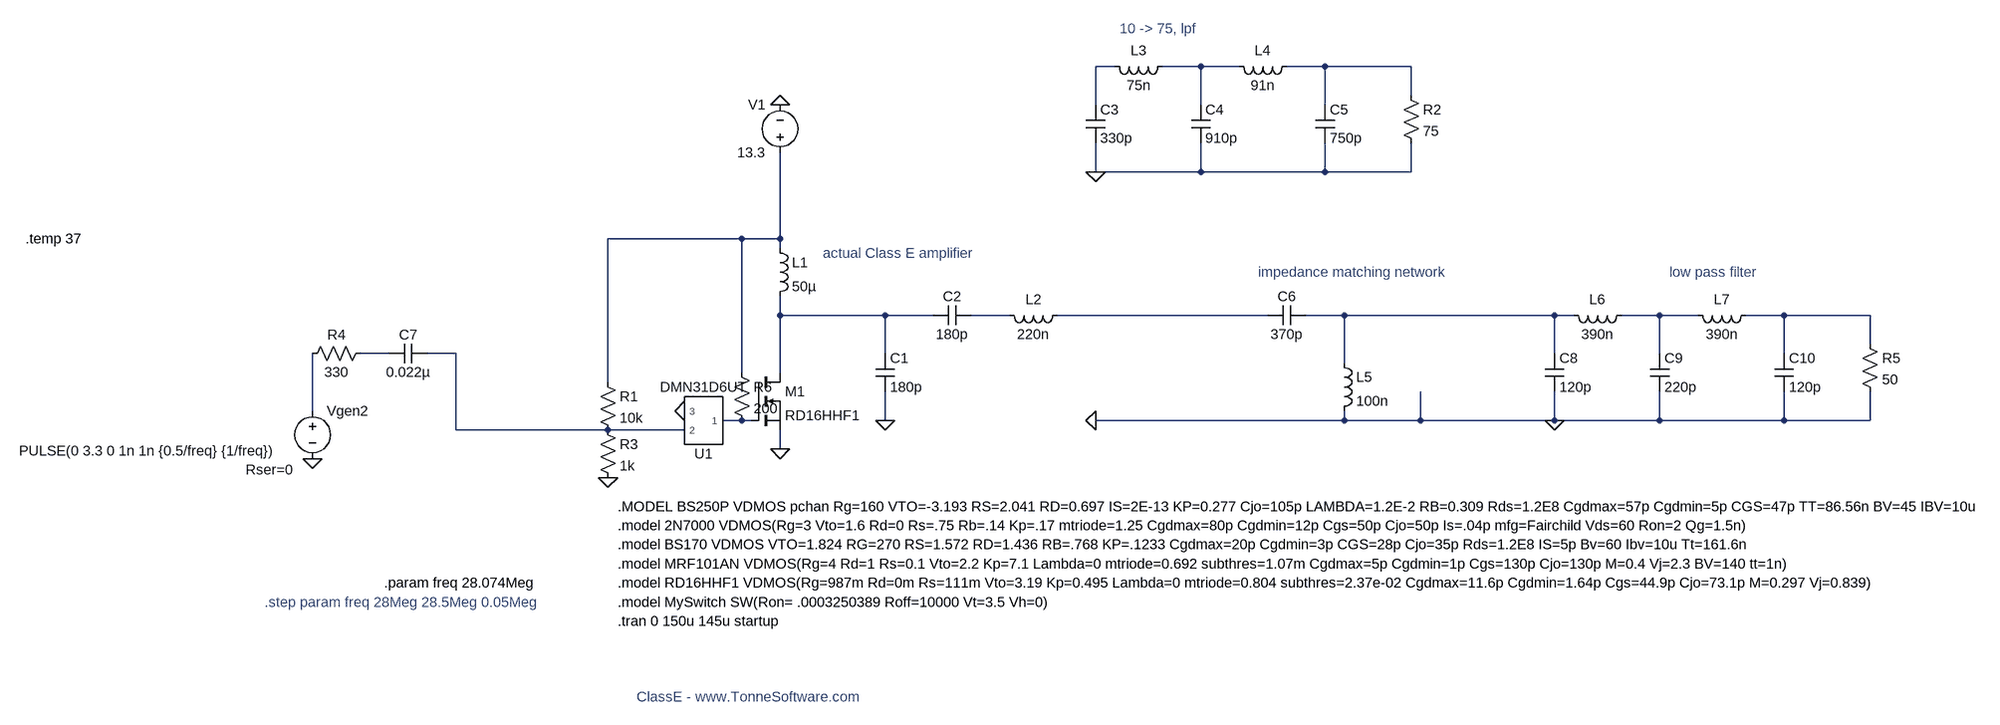
[diagram p0: schematic 28mhz_class_e_new.asc]
28mhz_class_e_new.asc, the LTspice schematic file:
Version 4
SHEET 1 2496 912
WIRE 832 -528 800 -528
WIRE 976 -528 912 -528
WIRE 1040 -528 976 -528
WIRE 1184 -528 1120 -528
WIRE 1328 -528 1184 -528
WIRE 1328 -480 1328 -528
WIRE 800 -464 800 -528
WIRE 976 -464 976 -528
WIRE 1184 -464 1184 -528
WIRE 800 -352 800 -400
WIRE 976 -352 976 -400
WIRE 976 -352 800 -352
WIRE 1184 -352 1184 -400
WIRE 1184 -352 976 -352
WIRE 1328 -352 1328 -400
WIRE 1328 -352 1184 -352
WIRE 208 -240 -16 -240
WIRE 272 -240 272 -384
WIRE 272 -240 208 -240
WIRE 272 -224 272 -240
WIRE 272 -112 272 -144
WIRE 448 -112 272 -112
WIRE 528 -112 448 -112
WIRE 656 -112 592 -112
WIRE 1088 -112 736 -112
WIRE 1216 -112 1152 -112
WIRE 1568 -112 1216 -112
WIRE 1600 -112 1568 -112
WIRE 1744 -112 1680 -112
WIRE 1808 -112 1744 -112
WIRE 1952 -112 1888 -112
WIRE 2096 -112 1952 -112
WIRE 2096 -64 2096 -112
WIRE -544 -48 -592 -48
WIRE -432 -48 -480 -48
WIRE 448 -48 448 -112
WIRE 1568 -48 1568 -112
WIRE 1744 -48 1744 -112
WIRE 1952 -48 1952 -112
WIRE 1216 -32 1216 -112
WIRE 208 -16 208 -240
WIRE 272 -16 272 -112
WIRE -16 0 -16 -240
WIRE -672 48 -672 -48
WIRE 208 64 176 64
WIRE 224 64 208 64
WIRE 448 64 448 16
WIRE 1216 64 1216 48
WIRE 1216 64 800 64
WIRE 1344 64 1344 16
WIRE 1344 64 1216 64
WIRE 1568 64 1568 16
WIRE 1568 64 1344 64
WIRE 1744 64 1744 16
WIRE 1744 64 1568 64
WIRE 1952 64 1952 16
WIRE 1952 64 1744 64
WIRE 2096 64 2096 16
WIRE 2096 64 1952 64
WIRE -432 80 -432 -48
WIRE -16 80 -432 80
WIRE 112 80 -16 80
WIRE 272 112 272 80
FLAG 272 112 0
FLAG 448 64 0
FLAG 800 64 0
FLAG -672 128 0
FLAG 800 -352 0
FLAG 1568 64 0
FLAG 272 -464 0
FLAG -16 160 0
FLAG 112 48 0
SYMBOL ind 256 -240 R0
SYMATTR InstName L1
SYMATTR Value 50µ
SYMBOL cap 432 -48 R0
SYMATTR InstName C1
SYMATTR Value 180p
SYMBOL cap 592 -128 R90
WINDOW 0 0 32 VBottom 2
WINDOW 3 32 32 VTop 2
SYMATTR InstName C2
SYMATTR Value 180p
SYMBOL nmos 224 -16 R0
SYMATTR InstName M1
SYMATTR Value RD16HHF1
SYMBOL voltage -672 32 R0
WINDOW 123 24 132 Left 0
WINDOW 39 -112 115 Left 2
WINDOW 3 -491 83 Left 2
SYMATTR SpiceLine Rser=0
SYMATTR Value PULSE(0 3.3 0 1n 1n {0.5/freq} {1/freq})
SYMATTR InstName Vgen2
SYMBOL ind 928 -544 R90
WINDOW 0 5 56 VBottom 2
WINDOW 3 32 56 VTop 2
SYMATTR InstName L3
SYMATTR Value 75n
SYMBOL ind 1136 -544 R90
WINDOW 0 5 56 VBottom 2
WINDOW 3 32 56 VTop 2
SYMATTR InstName L4
SYMATTR Value 91n
SYMBOL cap 784 -464 R0
SYMATTR InstName C3
SYMATTR Value 330p
SYMBOL cap 960 -464 R0
SYMATTR InstName C4
SYMATTR Value 910p
SYMBOL cap 1168 -464 R0
SYMATTR InstName C5
SYMATTR Value 750p
SYMBOL res 1312 -496 R0
SYMATTR InstName R2
SYMATTR Value 75
SYMBOL cap 1152 -128 R90
WINDOW 0 0 32 VBottom 2
WINDOW 3 32 32 VTop 2
SYMATTR InstName C6
SYMATTR Value 370p
SYMBOL ind 1200 -48 R0
SYMATTR InstName L5
SYMATTR Value 100n
SYMBOL ind 1696 -128 R90
WINDOW 0 5 56 VBottom 2
WINDOW 3 32 56 VTop 2
SYMATTR InstName L6
SYMATTR Value 390n
SYMBOL ind 1904 -128 R90
WINDOW 0 5 56 VBottom 2
WINDOW 3 32 56 VTop 2
SYMATTR InstName L7
SYMATTR Value 390n
SYMBOL cap 1552 -48 R0
SYMATTR InstName C8
SYMATTR Value 120p
SYMBOL cap 1728 -48 R0
SYMATTR InstName C9
SYMATTR Value 220p
SYMBOL cap 1936 -48 R0
SYMATTR InstName C10
SYMATTR Value 120p
SYMBOL res 2080 -80 R0
SYMATTR InstName R5
SYMATTR Value 50
SYMBOL voltage 272 -368 R180
WINDOW 0 24 96 Left 2
WINDOW 3 24 16 Left 2
WINDOW 123 0 0 Left 0
WINDOW 39 0 0 Left 0
SYMATTR InstName V1
SYMATTR Value 13.3
SYMBOL res -576 -64 R90
WINDOW 0 0 56 VBottom 2
WINDOW 3 32 56 VTop 2
SYMATTR InstName R4
SYMATTR Value 330
SYMBOL ind 752 -128 R90
WINDOW 0 5 56 VBottom 2
WINDOW 3 32 56 VTop 2
SYMATTR InstName L2
SYMATTR Value 220n
SYMBOL res -32 -16 R0
SYMATTR InstName R1
SYMATTR Value 10k
SYMBOL res -32 64 R0
SYMATTR InstName R3
SYMATTR Value 1k
SYMBOL res 192 -32 R0
SYMATTR InstName R6
SYMATTR Value 200
SYMBOL cap -480 -64 R90
WINDOW 0 0 32 VBottom 2
WINDOW 3 32 32 VTop 2
SYMATTR InstName C7
SYMATTR Value 0.022µ
SYMBOL DMN31D6UT 144 64 R180
SYMATTR InstName U1
TEXT 0 368 Left 2 !.model MySwitch SW(Ron= .0003250389 Roff=10000 Vt=3.5 Vh=0)
TEXT 0 400 Left 2 !.tran 0 150u 145u startup
TEXT 32 528 Left 2 ;ClassE - www.TonneSoftware.com
TEXT 0 336 Left 2 !.model RD16HHF1 VDMOS(Rg=987m Rd=0m Rs=111m Vto=3.19 Kp=0.495 Lambda=0 mtriode=0.804 subthres=2.37e-02 Cgdmax=11.6p Cgdmin=1.64p Cgs=44.9p Cjo=73.1p M=0.297 Vj=0.839)
TEXT 344 -216 Left 2 ;actual Class E amplifier
TEXT -552 336 Left 2 !.param freq 28.074Meg
TEXT -752 368 Left 2 ;.step param freq 28Meg 28.5Meg 0.05Meg
TEXT 840 -592 Left 2 ;10 -> 75, lpf
TEXT 1072 -184 Left 2 ;impedance matching network
TEXT 1760 -184 Left 2 ;low pass filter
TEXT 0 304 Left 2 !.model MRF101AN VDMOS(Rg=4 Rd=1 Rs=0.1 Vto=2.2 Kp=7.1 Lambda=0 mtriode=0.692 subthres=1.07m Cgdmax=5p Cgdmin=1p Cgs=130p Cjo=130p M=0.4 Vj=2.3 BV=140 tt=1n)
TEXT 0 272 Left 2 !.model BS170 VDMOS VTO=1.824 RG=270 RS=1.572 RD=1.436 RB=.768 KP=.1233 Cgdmax=20p Cgdmin=3p CGS=28p Cjo=35p Rds=1.2E8 IS=5p Bv=60 Ibv=10u Tt=161.6n
TEXT 0 240 Left 2 !.model 2N7000 VDMOS(Rg=3 Vto=1.6 Rd=0 Rs=.75 Rb=.14 Kp=.17 mtriode=1.25 Cgdmax=80p Cgdmin=12p Cgs=50p Cjo=50p Is=.04p mfg=Fairchild Vds=60 Ron=2 Qg=1.5n)
TEXT 0 208 Left 2 !.MODEL BS250P VDMOS pchan Rg=160 VTO=-3.193 RS=2.041 RD=0.697 IS=2E-13 KP=0.277 Cjo=105p LAMBDA=1.2E-2 RB=0.309 Rds=1.2E8 Cgdmax=57p Cgdmin=5p CGS=47p TT=86.56n BV=45 IBV=10u
TEXT -1152 -240 Left 2 !.temp 37

The netlist it stands for:
* 28mhz_class_e_new.asc
L1 N004 N005 50µ
C1 N005 0 180p
C2 N006 N005 180p
M1 N005 N014 0 0 RD16HHF1
Vgen2 N013 0 PULSE(0 3.3 0 1n 1n {0.5/freq} {1/freq}) Rser=0
L3 N002 N001 75n
L4 N003 N002 91n
C3 N001 0 330p
C4 N002 0 910p
C5 N003 0 750p
R2 N003 0 75
C6 N008 N007 370p
L5 N008 0 100n
L6 N009 N008 390n
L7 N010 N009 390n
C8 N008 0 120p
C9 N009 0 220p
C10 N010 0 120p
R5 N010 0 50
V1 N004 0 13.3
R4 N011 N013 330
L2 N007 N006 220n
R1 N004 N012 10k
R3 N012 0 1k
R6 N004 N014 200
C7 N012 N011 0.022µ
XU1 N014 N012 0 DMN31D6UT  ; pins 1 2 3
.model NMOS NMOS
.model PMOS PMOS
.lib standard.mos
.model MySwitch SW(Ron= .0003250389 Roff=10000 Vt=3.5 Vh=0)
.tran 0 150u 145u startup
* ClassE - www.TonneSoftware.com
.model RD16HHF1 VDMOS(Rg=987m Rd=0m Rs=111m Vto=3.19 Kp=0.495 Lambda=0 mtriode=0.804 subthres=2.37e-02 Cgdmax=11.6p Cgdmin=1.64p Cgs=44.9p Cjo=73.1p M=0.297 Vj=0.839)
* actual Class E amplifier
.param freq 28.074Meg
* .step param freq 28Meg 28.5Meg 0.05Meg
* 10 -> 75, lpf
* impedance matching network
* low pass filter
.model MRF101AN VDMOS(Rg=4 Rd=1 Rs=0.1 Vto=2.2 Kp=7.1 Lambda=0 mtriode=0.692 subthres=1.07m Cgdmax=5p Cgdmin=1p Cgs=130p Cjo=130p M=0.4 Vj=2.3 BV=140 tt=1n)
.model BS170 VDMOS VTO=1.824 RG=270 RS=1.572 RD=1.436 RB=.768 KP=.1233 Cgdmax=20p Cgdmin=3p CGS=28p Cjo=35p Rds=1.2E8 IS=5p Bv=60 Ibv=10u Tt=161.6n
.model 2N7000 VDMOS(Rg=3 Vto=1.6 Rd=0 Rs=.75 Rb=.14 Kp=.17 mtriode=1.25 Cgdmax=80p Cgdmin=12p Cgs=50p Cjo=50p Is=.04p mfg=Fairchild Vds=60 Ron=2 Qg=1.5n)
.MODEL BS250P VDMOS pchan Rg=160 VTO=-3.193 RS=2.041 RD=0.697 IS=2E-13 KP=0.277 Cjo=105p LAMBDA=1.2E-2 RB=0.309 Rds=1.2E8 Cgdmax=57p Cgdmin=5p CGS=47p TT=86.56n BV=45 IBV=10u
.temp 37
.lib Z:\home\bean\RadioNotes\DMN31D6UT.spice.txt
.backanno
.end